# Altium schematic sheet 1_P1.schdoc
size 309 x 223 mm; Symbol: Sheet-Symbol_A4; Device: Sheet-Symbol_A4; @Page Name: P1; @Create Date: 2023-04-06; @Page Count: 1; @Page No: 1; @Project Name: smartcar2023(not_use); @Schematic Name: Schematic2; @Update Date: 2023-05-09; Company: 嘉立创EDA; Page Size: A4; Version: V1.0
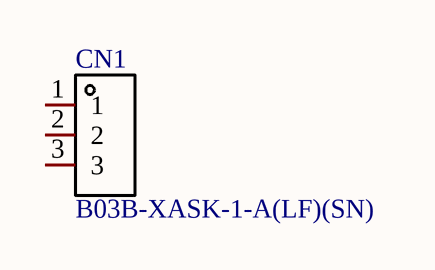
[diagram p0: 1_P1.schdoc]

## Parts
CN1  B03B-XASK-1-A(LF)(SN)  [CONN-TH_B03B-XASK-1-A-LF-SN]

## Nets

Not connected (* = marked no-connect by the designer): CN1 1 2 3

## Notes on the sheet
- 1
- 2
- 3
- 4
- 5
- 6
- A
- B
- C
- Schematic
- Schematic2
- Create Date
- Update Date
- 2023-04-06
- 2023-05-09
- Reviewed
- Drawed
- Page
- P1
- Part Number
- smartcar2023(not_use)
- D
- VER
- SIZE
- PAGE
- OF
- V1.0
- A4
- 嘉立创EDA

## Library data of the parts
CN1 = B03B-XASK-1-A(LF)(SN): 参考系列:XA;间距:2.5mm;插针结构:1x3P;排数:1;每排PIN数:3;行距:-;公母:公型插针;安装方式:直插;额定电流:3A;工作温度范围:-25℃~+85℃;; Manufacturer: JST; Add into BOM: yes; Reference Series: XA; Pitch: 2.5mm; Pins Structure: 1x3P; Number of PINs Per Row: 3; Gender: 公型插针; Current Rating (Max): 3A; Name: B03B-XASK-1-A(LF)(SN); Symbol: B03B-XASK-1-A(LF)(SN); Device: B03B-XASK-1-A(LF)(SN); LCSC Part Name: XA 2.5mm 1x3P 直插; Supplier Part: C264992; Manufacturer Part: B03B-XASK-1-A(LF)(SN); Supplier Footprint: 插件,P=2.5mm; JLCPCB Part Class: 扩展库; Datasheet: https://atta.szlcsc.com/upload/public/pdf/source/20200311/C495727_AFFD619C34763440ABB8D8A2B6067F44.pdf; Supplier: LCSC; Convert to PCB: yes; Number of Rows: 1; Row Spacing: -; Mounting Style: 直插; Operating Temperature Range: -25℃~+85℃